# EasyEDA schematic SCH_PCBrelayLM2596_2021-11-15.json
TITLE: switch & relays & buck; REV: 2.1; Date: 2018-10-27; Sheet: 1/1; Drawn By: Leo Rauschenberger
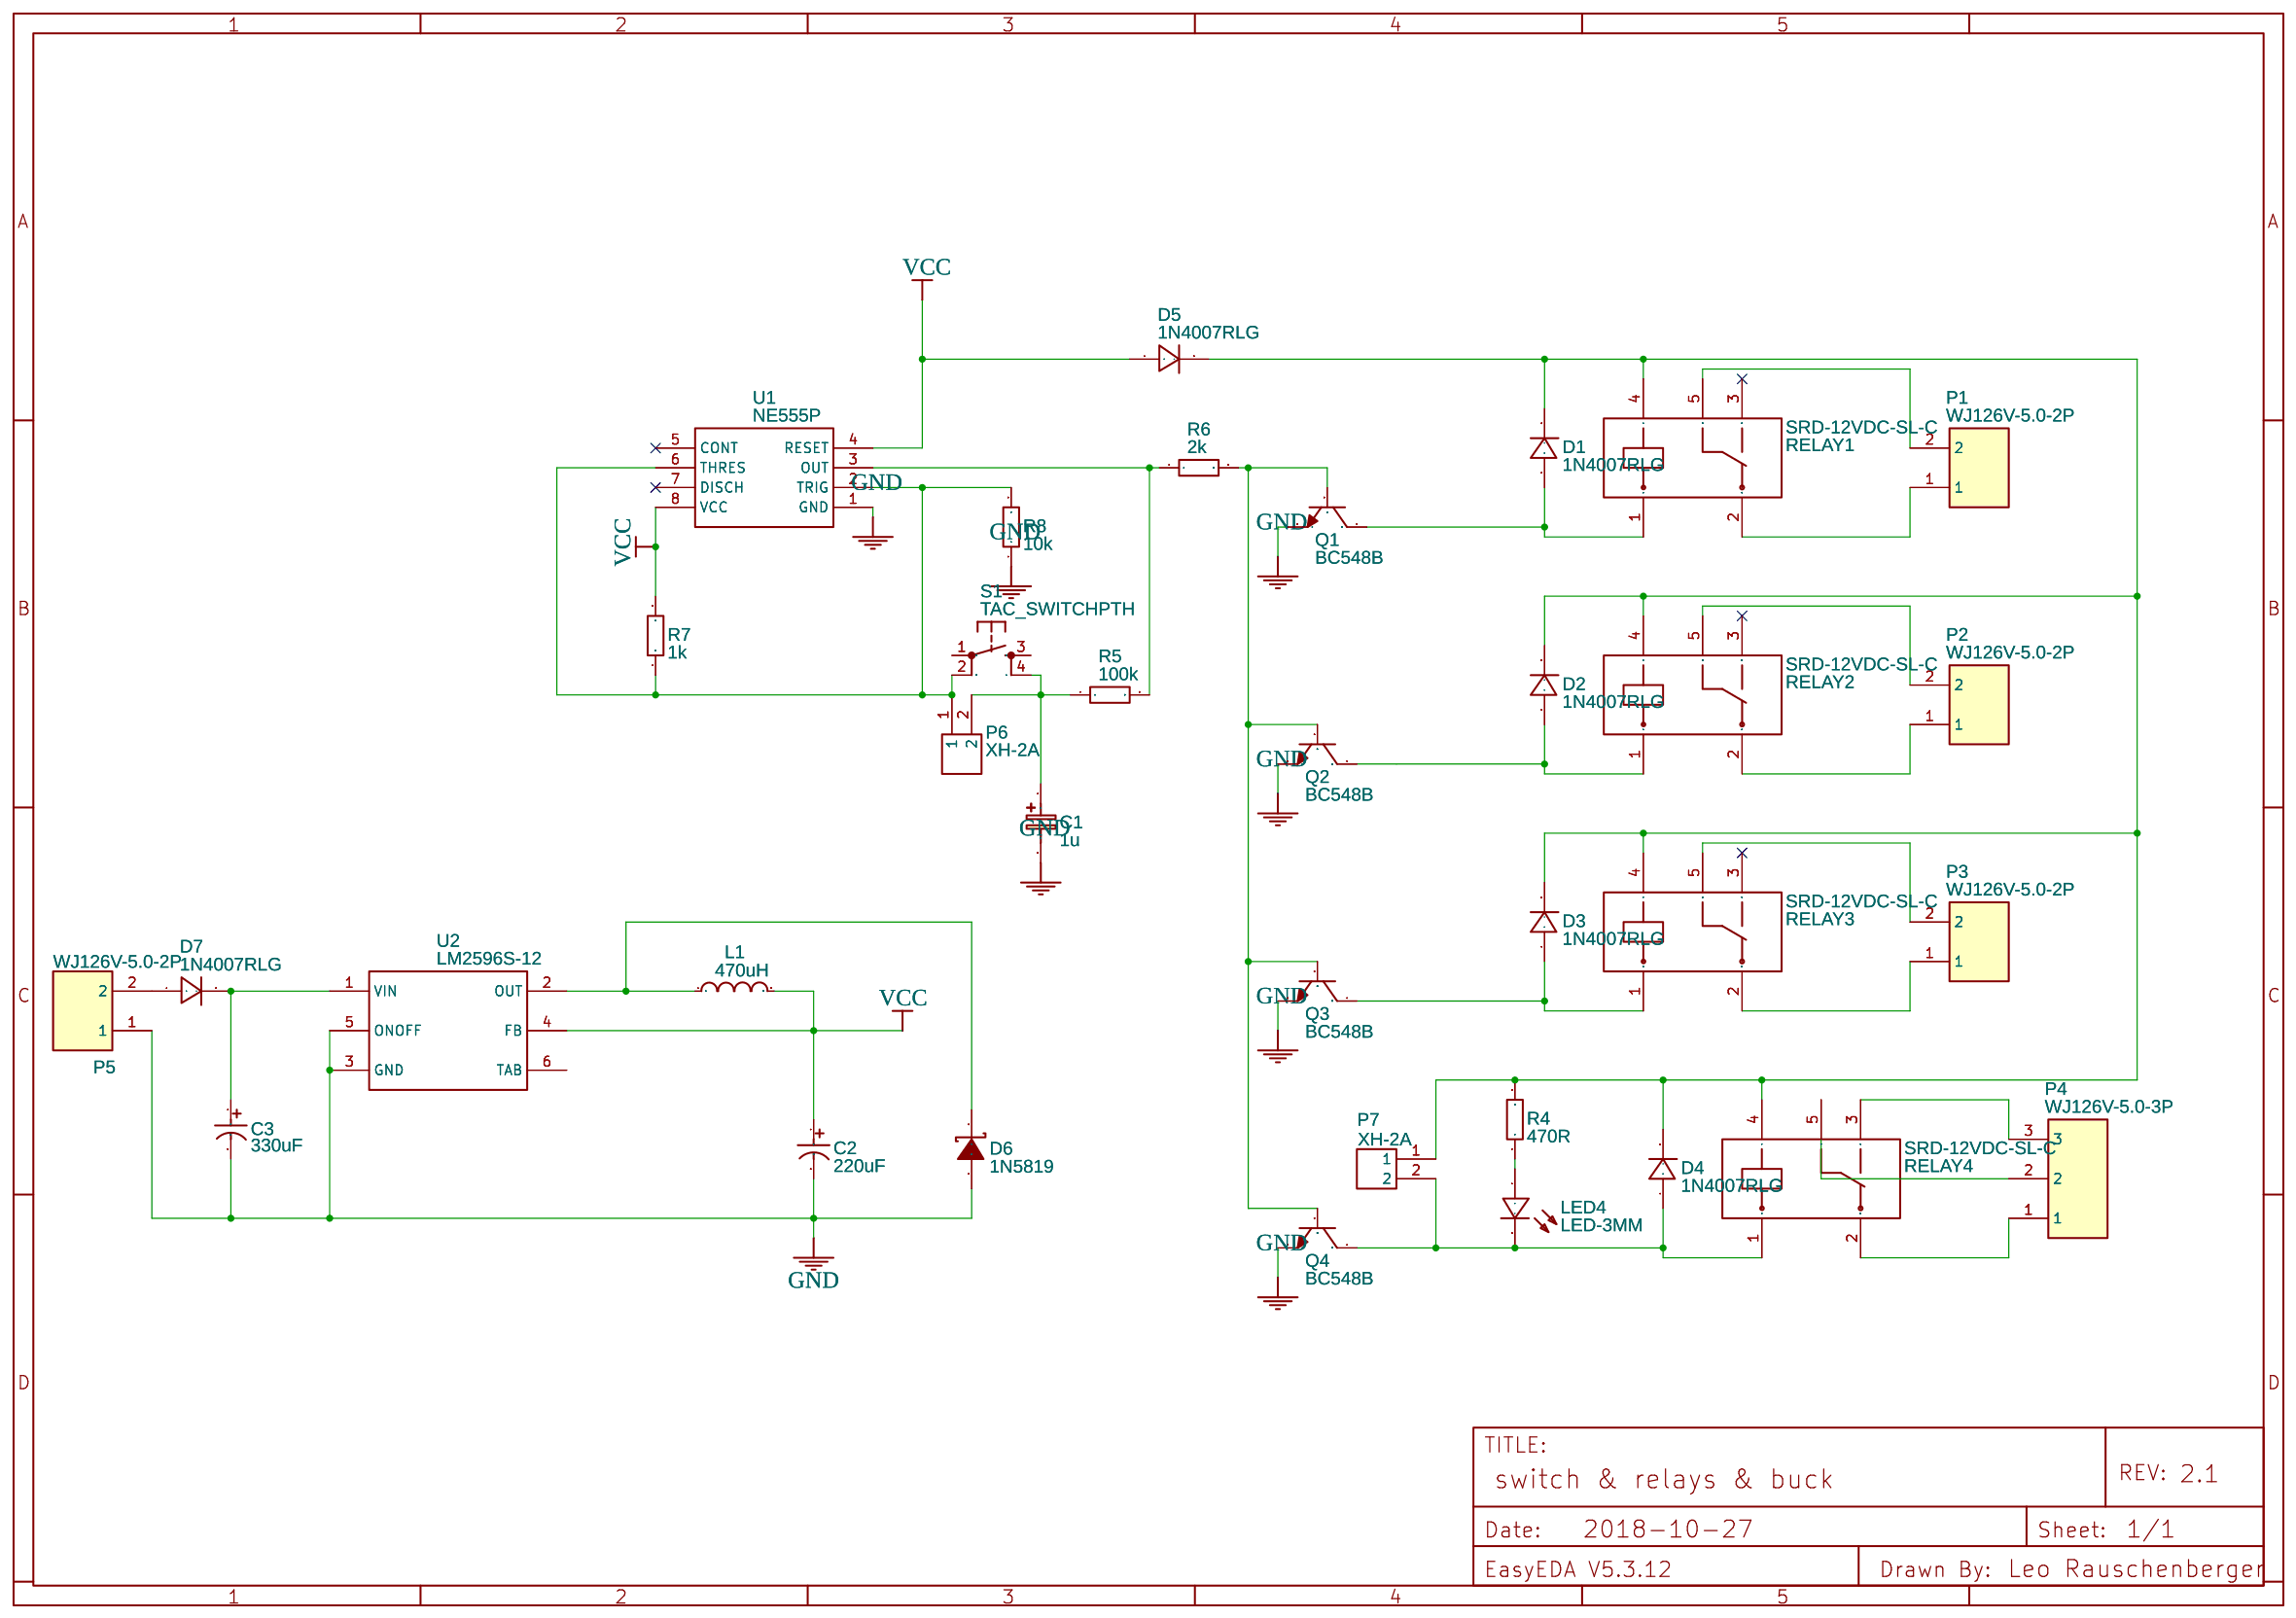
[diagram p0: schematic sheet]

## Parts
C1  1u  [CAP-D3.0XF1.5]
C2  220uF  [CAP-D6.3XF2.5]
C3  330uF  [CAP-D10.0XF5.0]
D1  1N4007RLG  [DO-41]
D2  1N4007RLG  [DO-41]
D3  1N4007RLG  [DO-41]
D4  1N4007RLG  [DO-41]
D5  1N4007RLG  [DO-41]
D6  1N5819  [DO-41]
D7  1N4007RLG  [DO-41]
L1  470uH  [IND-F6XP2.5]
LED4  LED-3MM  [LED-3MM/2.54]
P1  WJ126V-5.0-2P  [WJ126V-5.0-2P]
P2  WJ126V-5.0-2P  [WJ126V-5.0-2P]
P3  WJ126V-5.0-2P  [WJ126V-5.0-2P]
P4  WJ126V-5.0-3P  [WJ126V-5.0-3P]
P5  WJ126V-5.0-2P  [WJ126V-5.0-2P]
P6  XH-2A  [XH-2A]
P7  XH-2A  [XH-2A]
Q1  BC548B  [TO-92(TO-92-3)]
Q2  BC548B  [TO-92(TO-92-3)]
Q3  BC548B  [TO-92(TO-92-3)]
Q4  BC548B  [TO-92(TO-92-3)]
R4  470R  [AXIAL-0.4]
R5  100k  [AXIAL-0.4]
R6  2k  [AXIAL-0.4]
R7  1k  [AXIAL-0.4]
R8  10k  [AXIAL-0.4]
RELAY1  SRD-12VDC-SL-C  [RELAY-SL-SRD]
RELAY2  SRD-12VDC-SL-C  [RELAY-SL-SRD]
RELAY3  SRD-12VDC-SL-C  [RELAY-SL-SRD]
RELAY4  SRD-12VDC-SL-C  [RELAY-SL-SRD]
S1  TAC_SWITCHPTH  [TACTILE-PTH]
U1  NE555P  [DIP-8]
U2  LM2596S-12  [TO-263-5]

## Library data of the parts
C1 = Capacitor: Manufacturer Part: ?
C2 = 220uF 25V: Supplier: LCSC; Manufacturer: ValuePro; Contributor: LCSC; Supplier Part: C12450
C3 = 330uF 50V 10*20: Supplier: LCSC; Manufacturer: ValuePro; Contributor: LCSC; Supplier Part: C45108
D1-D5 D7 = -: Supplier: LCSC; Manufacturer: ON; image: http://image.lceda.cn/szlcsc/C53568.jpg; Supplier Part: C53568
D6 = -: Supplier: LCSC; Manufacturer: SEMTECH; Contributor: LCSC; Supplier Part: C84618
L1 = VLU0608-471K: Supplier: LCSC; Manufacturer: FH; Contributor: LCSC; Supplier Part: C128033
LED4 = -: Supplier: LCSC; Manufacturer: EVERLIGHT; Manufacturer Part: 204-10UYC/S530-A3; Supplier Part: undefined
P1-P3 P5 = -: Supplier: LCSC; Manufacturer: ReliaPro; image: //image.lceda.cn/szlcsc/C8404.jpg; Supplier Part: C8404
P4 = -: Supplier: LCSC; Manufacturer: ReliaPro; image: //image.lceda.cn/szlcsc/C8401.jpg; Supplier Part: C8401
P6 P7 = -: Supplier: LCSC; Manufacturer: BOOMELE; image: //image.lceda.cn/szlcsc/C20079.jpg; Supplier Part: C20079
Q1-Q4 = -: Supplier: LCSC; Manufacturer: CJ; image: //image.lceda.cn/szlcsc/C36611.jpg; Supplier Part: C36611
R4-R8 = Resistor: Manufacturer Part: ?
RELAY1-RELAY4 = -: Supplier: LCSC; Manufacturer: SONGLE; image: http://image.lceda.cn/szlcsc/C30431.jpg; Supplier Part: C30431
S1 = -: Momentary Switch; Contributor: SparkFun; Manufacturer Part: ?
U1 = -: Contributor: dillon; Supplier: LCSC; Manufacturer: TI; image: http://image.lceda.cn/szlcsc/C46749.jpg; Supplier Part: C46749
U2 = -: Supplier: LCSC; Manufacturer: TI; Manufacturer Part: LM2596SX-12; image: //image.lceda.cn/szlcsc/C17127.jpg; Contributor: LCSC; Supplier Part: C17127

## Nets
GND: C1.2 C2.2 C3.2 D6.1(A) P5.1 Q1.3(E) Q2.3(E) Q3.3(E) Q4.3(E) R8.1 U1.1(GND) U2.3(GND) U2.5(ONOFF)
VCC: C2.1 D5.1(+) L1.2 R7.2 U1.4(RESET) U1.8(VCC) U2.4(FB)
Net-(C1-1): C1.1 P6.2 R5.1 S1.4
Net-(C3-1): C3.1 D7.2(-) U2.1(VIN)
Net-(D1-1): D1.1(+) Q1.1(C) RELAY1.1
Net-(D1-2): D1.2(-) D2.2(-) D3.2(-) D4.2(-) D5.2(-) P7.1 R4.2 RELAY1.4 RELAY2.4 RELAY3.4 RELAY4.4
Net-(D2-1): D2.1(+) Q2.1(C) RELAY2.1
Net-(D3-1): D3.1(+) Q3.1(C) RELAY3.1
Net-(D4-1): D4.1(+) LED4.2(-) P7.2 Q4.1(C) RELAY4.1
Net-(D6-2): D6.2(K) L1.1 U2.2(OUT)
Net-(D7-1): D7.1(+) P5.2
Net-(LED4-1): LED4.1(+) R4.1
Net-(P1-1): P1.1 RELAY1.2
Net-(P1-2): P1.2 RELAY1.5
Net-(P2-1): P2.1 RELAY2.2
Net-(P2-2): P2.2 RELAY2.5
Net-(P3-1): P3.1 RELAY3.2
Net-(P3-2): P3.2 RELAY3.5
Net-(P4-1): P4.1 RELAY4.2
Net-(P4-2): P4.2 RELAY4.5
Net-(P4-3): P4.3 RELAY4.3
Net-(P6-1): P6.1 R7.1 R8.2 S1.2 U1.2(TRIG) U1.6(THRES)
Net-(Q1-2): Q1.2(B) Q2.2(B) Q3.2(B) Q4.2(B) R6.2
Net-(R5-2): R5.2 R6.1 U1.3(OUT)

Not connected (* = marked no-connect by the designer): RELAY1 3*; RELAY2 3*; RELAY3 3*; S1 1 3; U1 5(CONT)* 7(DISCH)*; U2 6(TAB)
